# EAGLE design PARKPCBTEENSY (EAGLE 9.3.0)
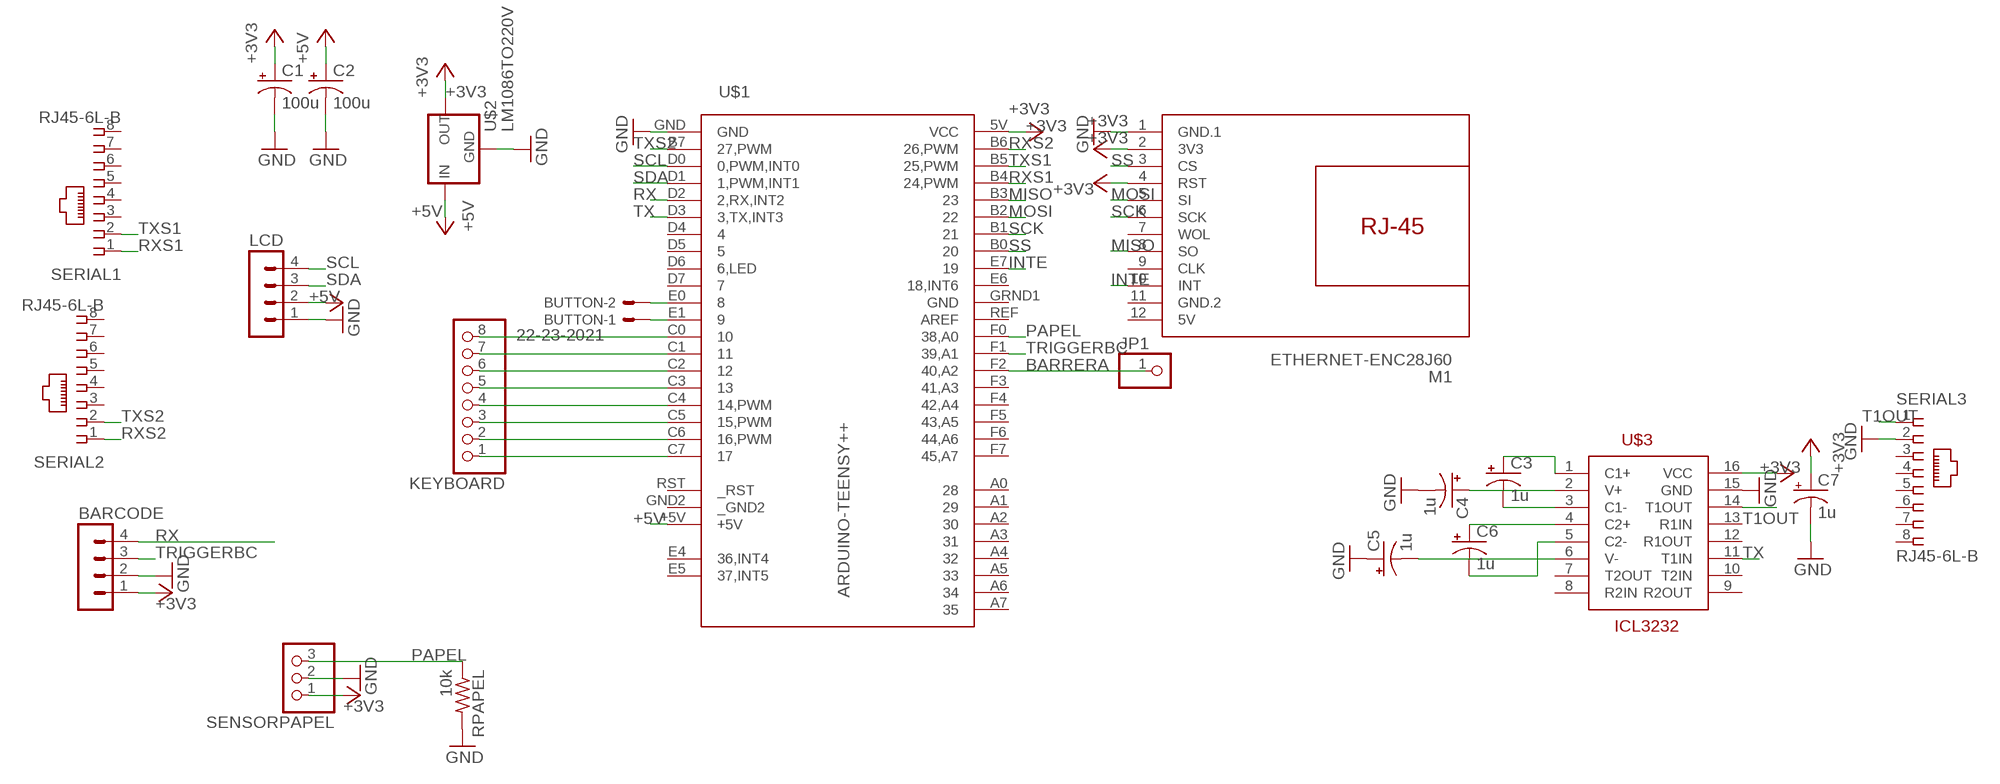
[diagram p0: schematic, sheet 1]

## Parts
BARCODE  MA04-1  [MA04-1]
BUTTON  22-23-2021  [22-23-2021]
C1  100u  CPOL-USB45181B  [B45181B]
C2  100u  CPOL-USB45181B  [B45181B]
C3  1u  CPOL-USB45181B  [B45181B]
C4  1u  CPOL-USB45181B  [B45181B]
C5  1u  CPOL-USB45181B  [B45181B]
C6  1u  CPOL-USB45181B  [B45181B]
C7  1u  CPOL-USB45181B  [B45181B]
JP1  PINHD-1X1  [1X01]
KEYBOARD  PINHD-1X8BIG  [1X08-BIG]
LCD  MA04-1  [MA04-1]
M1  ETHERNET-ENC28J60  [ETHERNET-ENC28J60]
RPAPEL  10k  R-US_0309/12  [0309/12]
SENSORPAPEL  PINHD-1X3  [1X03]
SERIAL1  RJ45-6L-B  [RJ45-NO-SHIELD]
SERIAL2  RJ45-6L-B  [RJ45-NO-SHIELD]
SERIAL3  RJ45-6L-B  [RJ45-NO-SHIELD]
U$1  ARDUINO-TEENSY++  [TEENSY++]
U$2  LM1086TO220V  [TO220S]
U$3  ICL3232  [DIL16]

## Nets
+3V3: BARCODE.1 C1.+ C7.+ M1.2(3V3) M1.4(RST) SENSORPAPEL.1 U$1.5V(VCC) U$2.2(OUT) U$3.16(VCC)
+5V: C2.+ LCD.2 U$1.+5V U$2.3(IN)
BARRERA: JP1.1 U$1.F2(40,A2)
GND: BARCODE.2 C1.- C2.- C4.- C5.+ C7.- LCD.1 M1.1(GND.1) RPAPEL.2 SENSORPAPEL.2 SERIAL3.2 U$1.GND U$2.1(GND) U$3.15(GND)
INTE: M1.10(INT) U$1.E7
MISO: M1.8(SO) U$1.B3
MOSI: M1.5(SI) U$1.B2
N$1: BUTTON.1 U$1.E1
N$2: BUTTON.2 U$1.E0
N$3: KEYBOARD.1 U$1.C7
N$4: KEYBOARD.2 U$1.C6(16,PWM)
N$5: KEYBOARD.3 U$1.C5(15,PWM)
N$6: KEYBOARD.4 U$1.C4(14,PWM)
N$7: KEYBOARD.5 U$1.C3
N$8: KEYBOARD.6 U$1.C2
N$9: KEYBOARD.7 U$1.C1
N$10: KEYBOARD.8 U$1.C0
N$11: C3.+ U$3.1(C1+)
N$12: C4.+ U$3.2(V+)
N$13: C3.- U$3.3(C1-)
N$14: C6.+ U$3.4(C2+)
N$15: C6.- U$3.5(C2-)
N$16: C5.- U$3.6(V-)
PAPEL: RPAPEL.1 SENSORPAPEL.3 U$1.F0(38,A0)
RX: BARCODE.4 U$1.D2(2,RX,INT2)
RXS1: SERIAL1.1 U$1.B4(24,PWM)
RXS2: SERIAL2.1 U$1.B6(26,PWM)
SCK: M1.6(SCK) U$1.B1
SCL: LCD.4 U$1.D0(0,PWM,INT0)
SDA: LCD.3 U$1.D1(1,PWM,INT1)
SS: M1.3(CS) U$1.B0
T1OUT: SERIAL3.1 U$3.14(T1OUT)
TRIGGERBC: BARCODE.3 U$1.F1(39,A1)
TX: U$1.D3(3,TX,INT3) U$3.11(T1IN)
TXS1: SERIAL1.2 U$1.B5(25,PWM)
TXS2: SERIAL2.2 U$1.B7(27,PWM)
Unconnected: M1.7(WOL) M1.9(CLK) SERIAL1.3 SERIAL1.4 SERIAL1.5 SERIAL1.6 SERIAL1.7 SERIAL1.8 SERIAL2.3 SERIAL2.4 SERIAL2.5 SERIAL2.6 SERIAL2.7 SERIAL2.8 SERIAL3.3 SERIAL3.4 SERIAL3.5 SERIAL3.6 SERIAL3.7 SERIAL3.8 U$1.A0 U$1.A1 U$1.A2 U$1.A3 U$1.A4 U$1.A5 U$1.A6 U$1.A7 U$1.D4 U$1.D5 U$1.D6(6,LED) U$1.D7 U$1.E4(36,INT4) U$1.E5(37,INT5) U$1.E6(18,INT6) U$1.F3(41,A3) U$1.F4(42,A4) U$1.F5(43,A5) U$1.F6(44,A6) U$1.F7(45,A7) U$1.REF(AREF) U$1.RST(_RST) U$3.7(T2OUT) U$3.8(R2IN) U$3.9(R2OUT) U$3.10(T2IN) U$3.12(R1OUT) U$3.13(R1IN)

## Power pins joined to a net without a drawn wire
5V: M1.12(5V)
_GND2: U$1.GND2(_GND2)
GND: U$1.GRND1(GND)
GND.2: M1.11(GND.2)

## Library data of the parts
BARCODE LCD = con-lstb:MA04-1: PIN HEADER; OC_FARNELL: unknown; OC_NEWARK: unknown
BUTTON = con-molex:22-23-2021: .100" (2.54mm) Center Header - 2 Pin; MF: MOLEX; MPN: 22-23-2021; OC_FARNELL: 1462926; OC_NEWARK: 25C3832
C1-C7 = rcl:CPOL-US: POLARIZED CAPACITOR, American symbol; SPICEPREFIX: C
JP1 = adafruit:PINHD-1X1: Pin header 1x1 for 0.1" spacing With round pins
KEYBOARD = adafruit:PINHD-1X8: PIN HEADER
M1 = diy-modules:ETHERNET-ENC28J60: Ethernet Module based on ENC28J60 chip Click here to find device on ebay.com <http://www.ebay.com/sch/end28j60+ethernet+lan+module> Note: There are many variants. Search for the proper version.
RPAPEL = rcl:R-US_: RESISTOR, American symbol; SPICEPREFIX: R
SENSORPAPEL = adafruit:PINHD-1X3: PIN HEADER
SERIAL1-SERIAL3 = con-tycoelectronics:RJ45: CORCOM Modular RJ Jacks No Shield Source: www.tycoelectronics.com .. ENG_DS_1654001_1099_RJ_L_0507.pdf; MPN: RJ45-6L-B; OC_FARNELL: unknown; OC_NEWARK: 16R6090
U$1 = teensypp:ARDUINO-TEENSY++
U$2 = v-reg-2:LM1086
U$3 = ICL3232:ICL3232: 3V to RS-232 transceiver; AVAILABILITY: Unavailable; MF: Intersil; MP: ICL3232; PACKAGE: None; PRICE: None

## Board
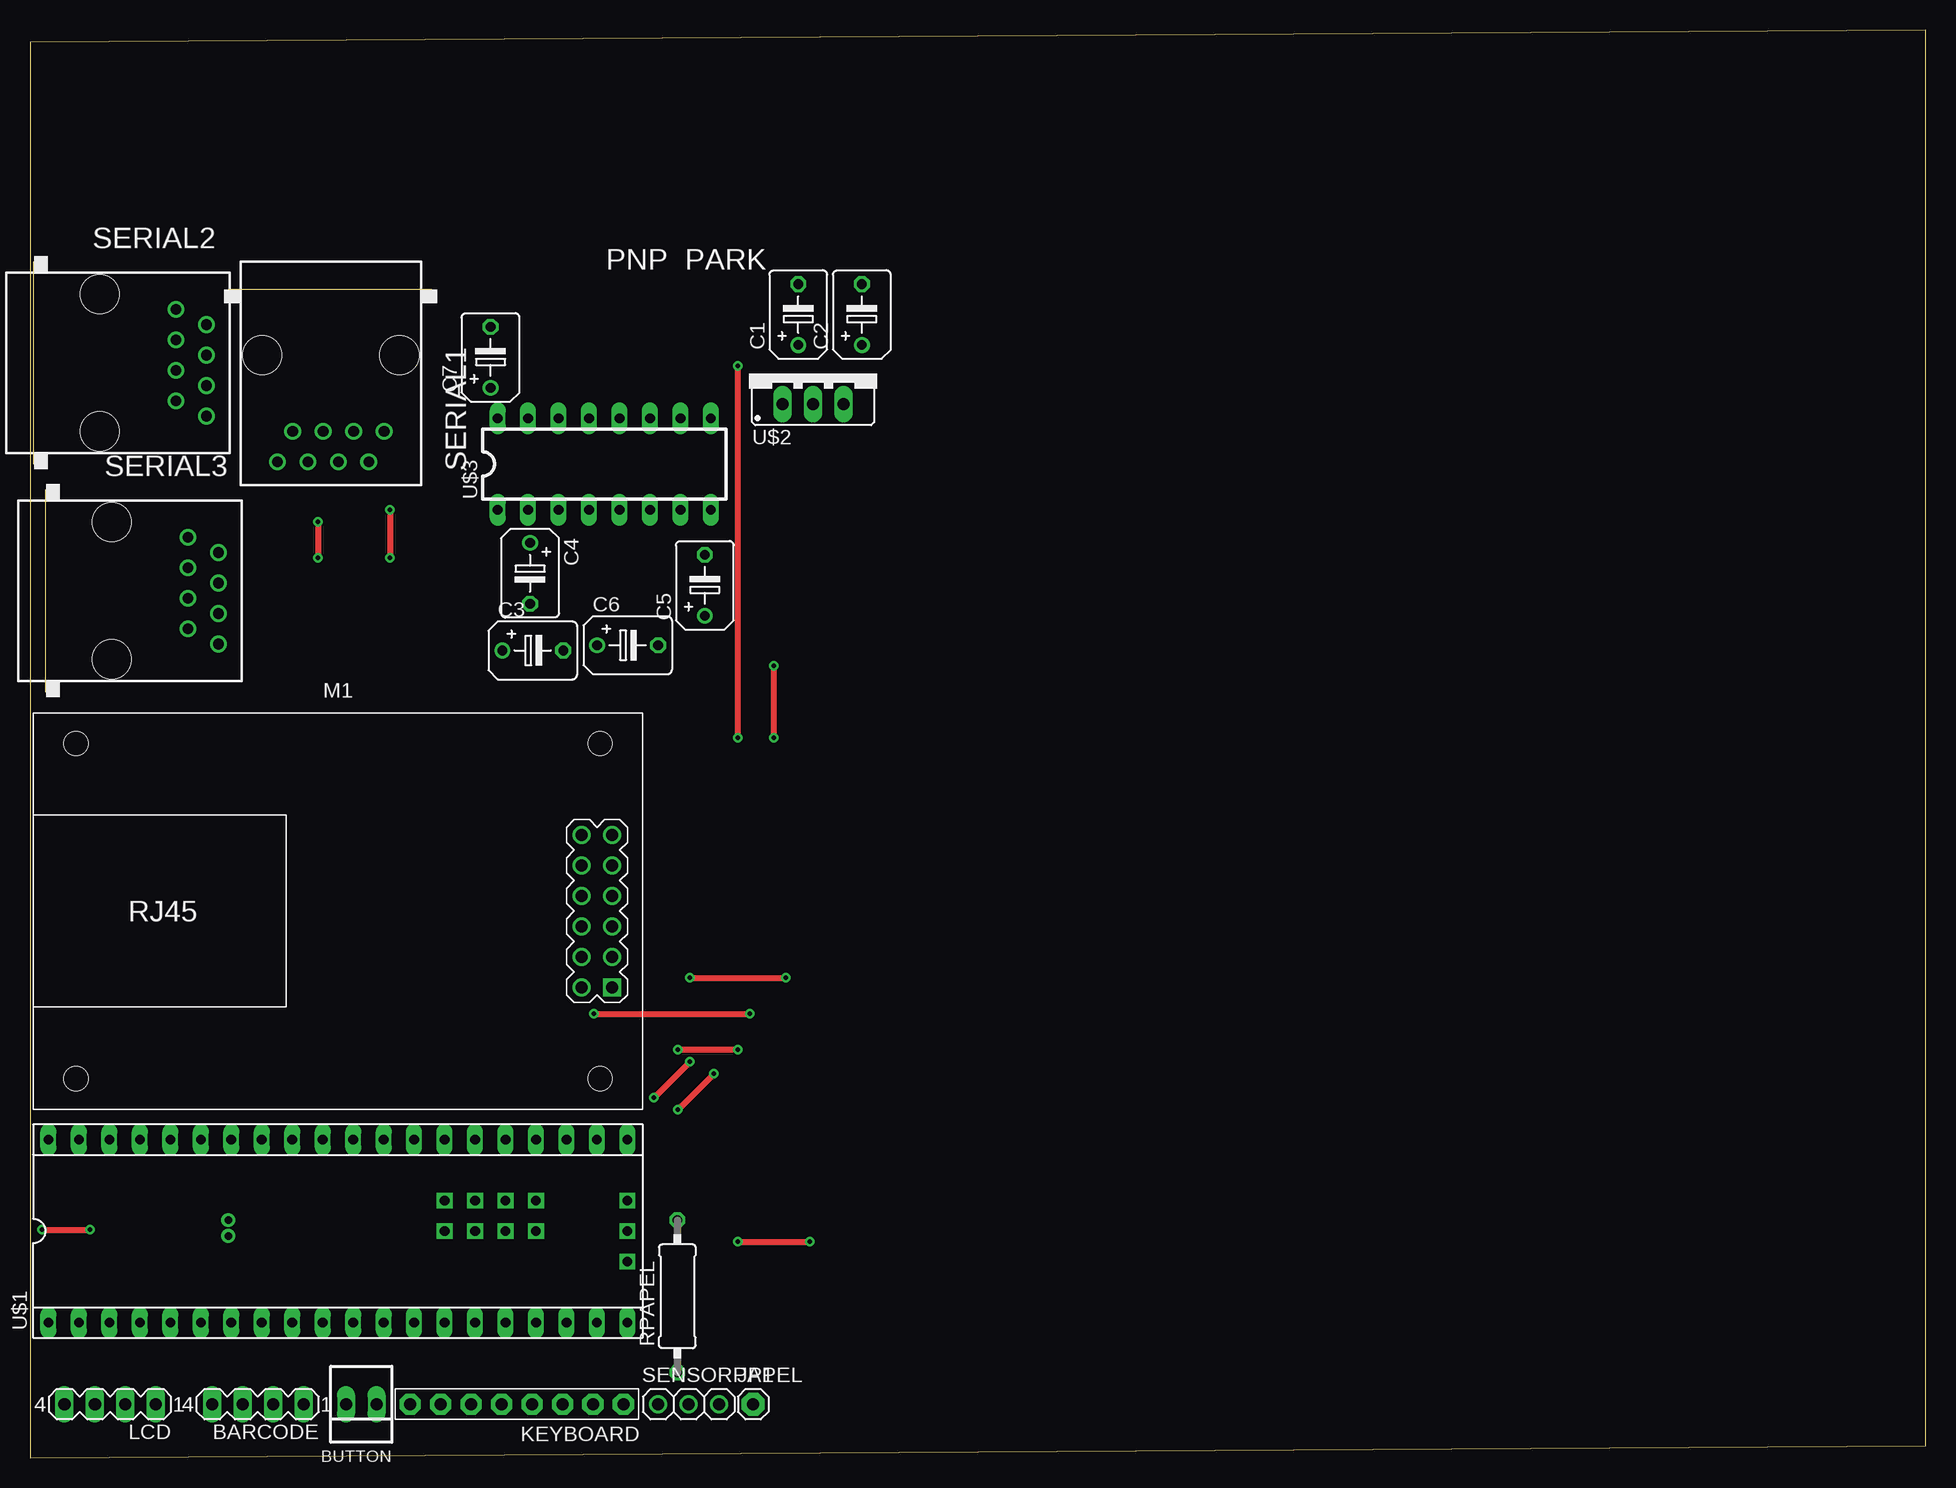
[diagram p1: board, top side]
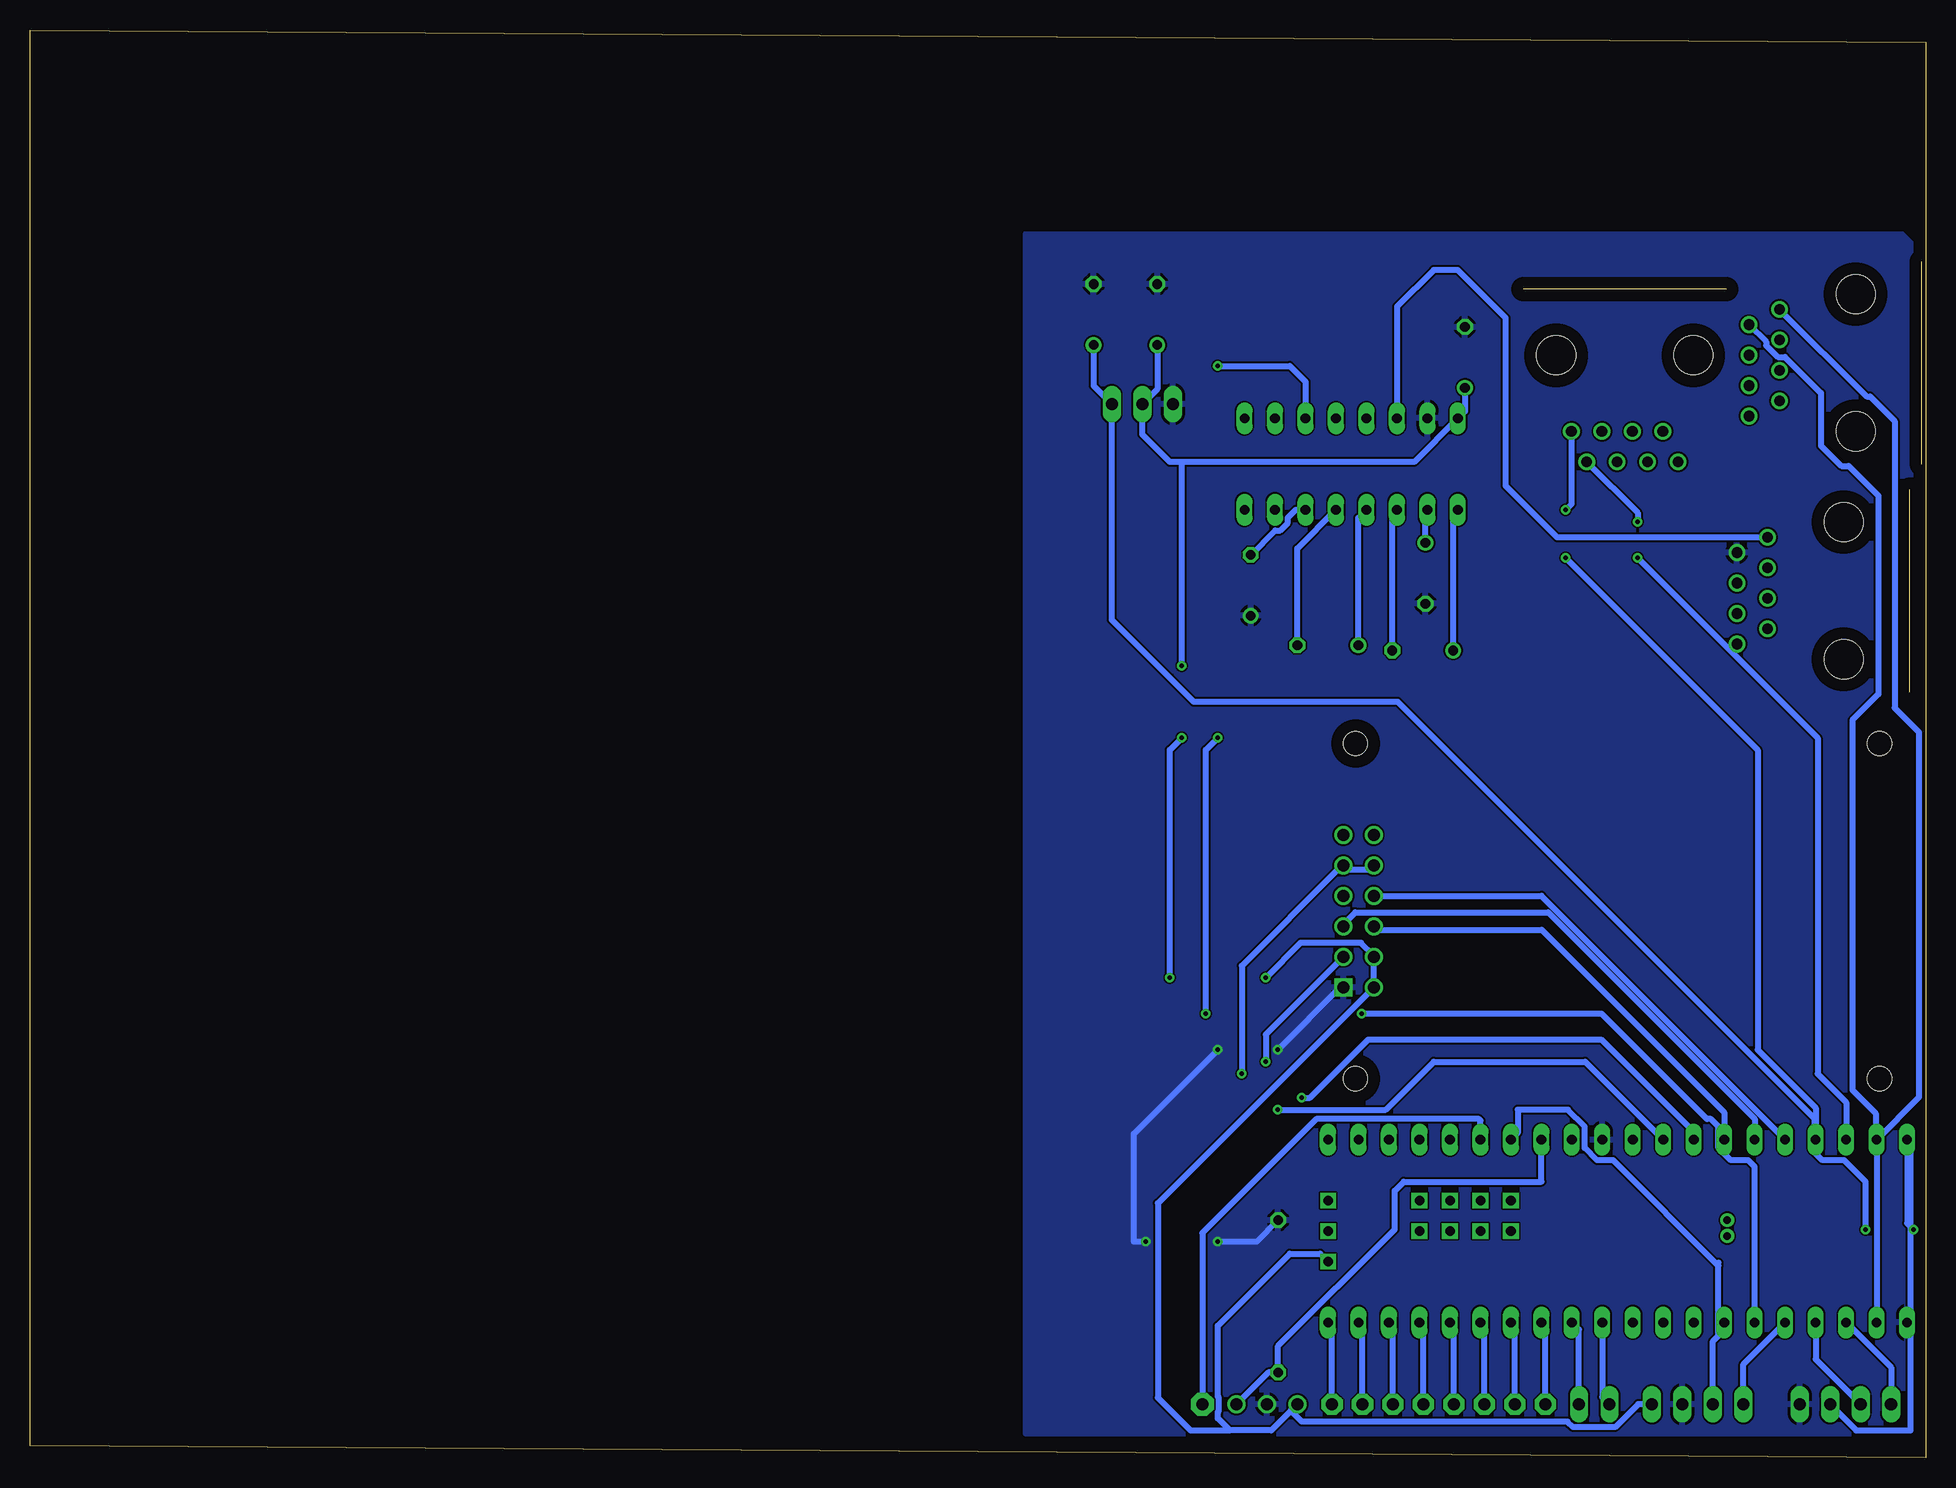
[diagram p2: board, bottom side, seen from below]

Size 158 x 119 mm. Coordinates in mm from the lower left corner, seen from the top.
Outline: 0,0 158,1 158,119 0,118 0,0
Copper layers (1*16): Top 0.035mm / dielectric 1.5mm / Bottom 0.035mm
Design rules "default": minimum track width 6mil, minimum drill 0.35mm, track to track 6mil, track to pad 6mil, pad to pad 6mil, via to via 6mil, smd to smd 6mil, copper to edge 40mil, drill to drill 6mil, minimum pad ring 10mil, minimum via ring 8mil, stop-mask expansion 4mil, vias tented up to drill 0mil, thermal gap 10mil

### Footprints (pad centres in the part's own frame; a part is rotated, then mirrored left to right if it is on the bottom)
MA04-1 = drill 1.016 long: 1 -3.81,0; 2 -1.27,0; 3 1.27,0; 4 3.81,0
22-23-2021 = drill 1 long: 1 -1.27,0; 2 1.27,0
B45181B = drill 0.813: + -2.54,0 | drill 0.813 octagon: - 2.54,0
1X01 = drill 1.016 pad 1.93 octagon: 1 0,0
1X08-BIG = drill 1.016 pad 1.778 octagon: 1 -8.89,0; 2 -6.35,0; 3 -3.81,0; 4 -1.27,0; 5 1.27,0; 6 3.81,0; 7 6.35,0; 8 8.89,0
ETHERNET-ENC28J60 = drill 1 square: 1 22.86,-6.35 | drill 1: 2 20.32,-6.35; 3 22.86,-3.81; 4 20.32,-3.81; 5 22.86,-1.27; 6 20.32,-1.27; 7 22.86,1.27; 8 20.32,1.27; 9 22.86,3.81; 10 20.32,3.81; 11 22.86,6.35; 12 20.32,6.35 | hole 2: -21.844,13.97; 21.844,13.97; -21.844,-13.97; 21.844,-13.97
0309/12 = drill 0.813 octagon: 1 -6.35,0; 2 6.35,0
1X03 = drill 1.016: 1 -2.54,0; 2 0,0; 3 2.54,0
RJ45-NO-SHIELD = drill 0.9 pad 1.4: 1 -4.445,6.35; 2 -3.175,8.89; 3 -1.905,6.35; 4 -0.635,8.89; 5 0.635,6.35; 6 1.905,8.89; 7 3.175,6.35; 8 4.445,8.89 | hole 3.251: -5.715,0; 5.715,0
TEENSY++ = drill 0.8 square: 5V 24.13,-2.54; A0 8.89,0; A1 11.43,0; A2 13.97,0; A3 16.51,0; A4 8.89,2.54; A5 11.43,2.54; A6 13.97,2.54; A7 16.51,2.54; GND2 24.13,0; RST 24.13,2.54 | drill 0.813 long: +5V -24.13,7.62; B0 -6.35,7.62; B1 -8.89,7.62; B2 -11.43,7.62; B3 -13.97,7.62; B4 -16.51,7.62; B5 -19.05,7.62; B6 -21.59,7.62; B7 -21.59,-7.62; C0 6.35,-7.62; C1 8.89,-7.62; C2 11.43,-7.62; C3 13.97,-7.62; C4 16.51,-7.62; C5 19.05,-7.62; C6 21.59,-7.62; C7 24.13,-7.62; D0 -19.05,-7.62; D1 -16.51,-7.62; D2 -13.97,-7.62; D3 -11.43,-7.62; D4 -8.89,-7.62; D5 -6.35,-7.62; D6 -3.81,-7.62; D7 -1.27,-7.62; E0 1.27,-7.62; E1 3.81,-7.62; E6 -1.27,7.62; E7 -3.81,7.62; F0 6.35,7.62; F1 8.89,7.62; F2 11.43,7.62; F3 13.97,7.62; F4 16.51,7.62; F5 19.05,7.62; F6 21.59,7.62; F7 24.13,7.62; GND -24.13,-7.62; GRND1 1.27,7.62; REF 3.81,7.62 | drill 0.635 pad 1.067: E4 -9.144,0.914; E5 -9.144,-0.406
TO220S = drill 1.016 long: 1 -2.54,-2.54; 2 0,-2.54; 3 2.54,-2.54
DIL16 = drill 0.813 long: 1 -8.89,-3.81; 2 -6.35,-3.81; 3 -3.81,-3.81; 4 -1.27,-3.81; 5 1.27,-3.81; 6 3.81,-3.81; 7 6.35,-3.81; 8 8.89,-3.81; 9 8.89,3.81; 10 6.35,3.81; 11 3.81,3.81; 12 1.27,3.81; 13 -1.27,3.81; 14 -3.81,3.81; 15 -6.35,3.81; 16 -8.89,3.81

### Placement (x,y rotation side)
BARCODE  18.99,4.44 180 top
BUTTON  27.61,4.44 180 top
C1  64.04,95.28 90 top
C2  69.34,95.28 90 top
C3  41.91,67.28 0 top
C4  41.68,73.71 270 top
C5  56.25,72.71 90 top
C6  49.82,67.71 0 top
C7  38.39,91.71 90 top
JP1  60.28,4.44 0 top
KEYBOARD  40.58,4.44 180 top
LCD  6.68,4.44 180 top
M1  25.67,45.55 0 top
RPAPEL  53.96,13.44 90 top
SENSORPAPEL  54.9,4.44 0 top
SERIAL1  25.07,91.89 180 top
SERIAL2  5.82,91.26 270 top
SERIAL3  6.82,72.26 270 top
U$1  25.67,18.88 0 top
U$2  65.28,90.36 0 top
U$3  47.87,82.82 0 top

### Tracks (layer width: path | path; a pad name or v marks a point on that pad's centre or on a via)
+3V3  (via drill 0.35)
  Top 0.508: v55,40 v63,40 | v62,60 v62,66
  Bottom 0.508: SENSORPAPEL.1 52.9,3.9 | 52.9,3.9 54.53,2.27 58,2.27 | 58,2.27 59,3.27 59,3.78 58.91,3.87 58.91,5.01 59,5.1 59,11 53,17 50.46,17 U$1.5V | BARCODE.1 23.95,4.44 25.86,2.53 29.36,2.53 29.84,3 52,3 52.9,3.9 | 58,2.27 61.27,2.27 64,5 64,21.19 M1.2 M1.4 45.99,41.84 47.05,42.9 52.1,42.9 v55,40 | C7.+ 38.39,87.22 U$3.16 42.61,83 62,83 | C1.+ 64.04,89.06 U$2.2 65.28,85.28 63,83 62,83 | v63,40 63,59 v62,60 | v62,66 62,83
+5V  (via drill 0.35)
  Top 0.508: v1,19 v5,19
  Bottom 0.508: LCD.2 5.78,2.27 1.27,2.27 1.27,26.23 U$1.+5V 1.54,19.54 v1,19 | C2.+ 69.34,89.34 U$2.3 67.82,69.82 61,63 44,63 9.23,28.23 9.23,25.4 8.6,24.77 6.77,24.77 5,23 v5,19
BARRERA
  Bottom 0.508: JP1.1 60.28,18.72 50.77,28.23 37.23,28.23 37.1,28.1 U$1.F2
GND  (via drill 0.35)
  Top 0.508: v59,18 v65,18 | v59,34 v54,34
  Bottom 0.508: RPAPEL.2 55.75,18 v59,18 | v65,18 66,18 66,27 v59,34 | v54,34 48.8,39.2 M1.1
  pour Bottom: -1,1 0,2 75,2 75,102 2,102 -1,99
INTE  (via drill 0.35)
  Top 0.508: v57,32 v54,29
  Bottom 0.508: M1.10 46.37,48.98 49.01,48.98 57,40.99 v57,32 | v54,29 45,29 41,33 28.36,33 U$1.E7
MISO
  Bottom 0.508: M1.8 32.02,46.82 U$1.B3
MOSI
  Bottom 0.508: M1.5 48.53,44.44 47.53,45.44 31.44,45.44 14.24,28.24 U$1.B2
N$1
  Bottom 0.508: BUTTON.1 28.88,10.66 U$1.E1
N$2
  Bottom 0.508: U$1.E0 26.94,5.04 BUTTON.2
N$3
  Bottom 0.508: KEYBOARD.1 49.47,10.93 U$1.C7
N$4
  Bottom 0.508: KEYBOARD.2 46.93,10.93 U$1.C6
N$5
  Bottom 0.508: KEYBOARD.3 44.39,10.93 U$1.C5
N$6
  Bottom 0.508: KEYBOARD.4 41.85,10.93 U$1.C4
N$7
  Bottom 0.508: KEYBOARD.5 39.31,10.93 U$1.C3
N$8
  Bottom 0.508: KEYBOARD.6 36.77,10.93 U$1.C2
N$9
  Bottom 0.508: KEYBOARD.7 34.23,10.93 U$1.C1
N$10
  Bottom 0.508: KEYBOARD.8 31.69,10.93 U$1.C0
N$11
  Bottom 0.508: C3.+ 39.37,78.62 U$3.1
N$12
  Bottom 0.508: C4.+ 41.68,78.85 U$3.2
N$13
  Bottom 0.508: C3.- 44.45,78.62 U$3.3
N$14
  Bottom 0.508: C6.+ 47.28,78.33 U$3.4
N$15
  Bottom 0.508: C6.- 52.36,75.79 U$3.5
N$16
  Bottom 0.508: U$3.6 52.49,79.01 53.15,78.35 53.15,77.91 53.78,77.28 54.22,77.28 C5.-
PAPEL
  Bottom 0.508: SENSORPAPEL.3 54.79,7.09 RPAPEL.1 53.96,9.3 44.24,19.02 44.24,22.24 43.48,23 32.02,23 U$1.F0
RX
  Bottom 0.508: BARCODE.4 15.18,7.78 U$1.D2
RXS1  (via drill 0.35)
  Top 0.508: v30,79 v30,75
  Bottom 0.508: SERIAL1.1 29.52,79.48 v30,79 | v30,75 14,59 14,34 9.16,29.16 U$1.B4
RXS2
  Bottom 0.508: SERIAL2.1 4.91,88.44 4.62,88.44 2.58,86.4 2.58,62.49 0.56,60.46 0.56,30.02 U$1.B6
SCK
  Bottom 0.508: M1.6 45.71,44 32,44 16.78,28.78 U$1.B1
SCL
  Bottom 0.508: U$1.D0 2.87,7.51 LCD.4
SDA
  Bottom 0.508: U$1.D1 9.16,8.19 LCD.3
SS  (via drill 0.35)
  Top 0.508: v55,33 v52,30
  Bottom 0.508: M1.3 55,35.27 v55,33 | U$1.B0 19.32,27.13 27.04,34.85 46.45,34.85 51.3,30 v52,30
T1OUT
  Bottom 0.508: SERIAL3.1 30.7,76.7 35,81 35,95 39,99 41,99 44.06,95.94 U$3.14
TRIGGERBC
  Bottom 0.508: BARCODE.3 17.72,9.69 17.25,10.16 17.25,16 | 17.25,16 17.25,16.25 | U$1.F1 34,27.06 34,29 29.81,29 28.41,27.6 28.41,25.8 27.38,24.77 26.03,24.77 17.25,16
TX  (via drill 0.35)
  Top 0.508: v47,37 v60,37 | v59,60 v59,91
  Bottom 0.508: U$1.D3 14.24,24.24 14.77,24.77 16.22,24.77 17.25,25.8 17.25,27.6 17.88,28.23 18.23,28.23 27,37 v47,37 | v60,37 60,59 v59,60 | v59,91 53,91 51.68,89.68 U$3.11
TXS1  (via drill 0.35)
  Top 0.508: v24,78 v24,75
  Bottom 0.508: SERIAL1.2 24,78.75 v24,78 | v24,75 9,60 9,32 6.62,29.62 U$1.B5
TXS2
  Bottom 0.508: SERIAL2.2 13.28,93 13.28,92.7 12.31,91.73 11.71,91.73 8.72,88.74 8.72,84.35 7.02,82.65 6.4,82.65 3.92,80.17 3.92,63.63 6.1,61.46 6.1,30.64 4.15,28.69 4.15,25.4 4.08,25.33 U$1.B7

### Text on the board
tNames: PNP PARK